# EAGLE design licht (EAGLE 6.6.0)
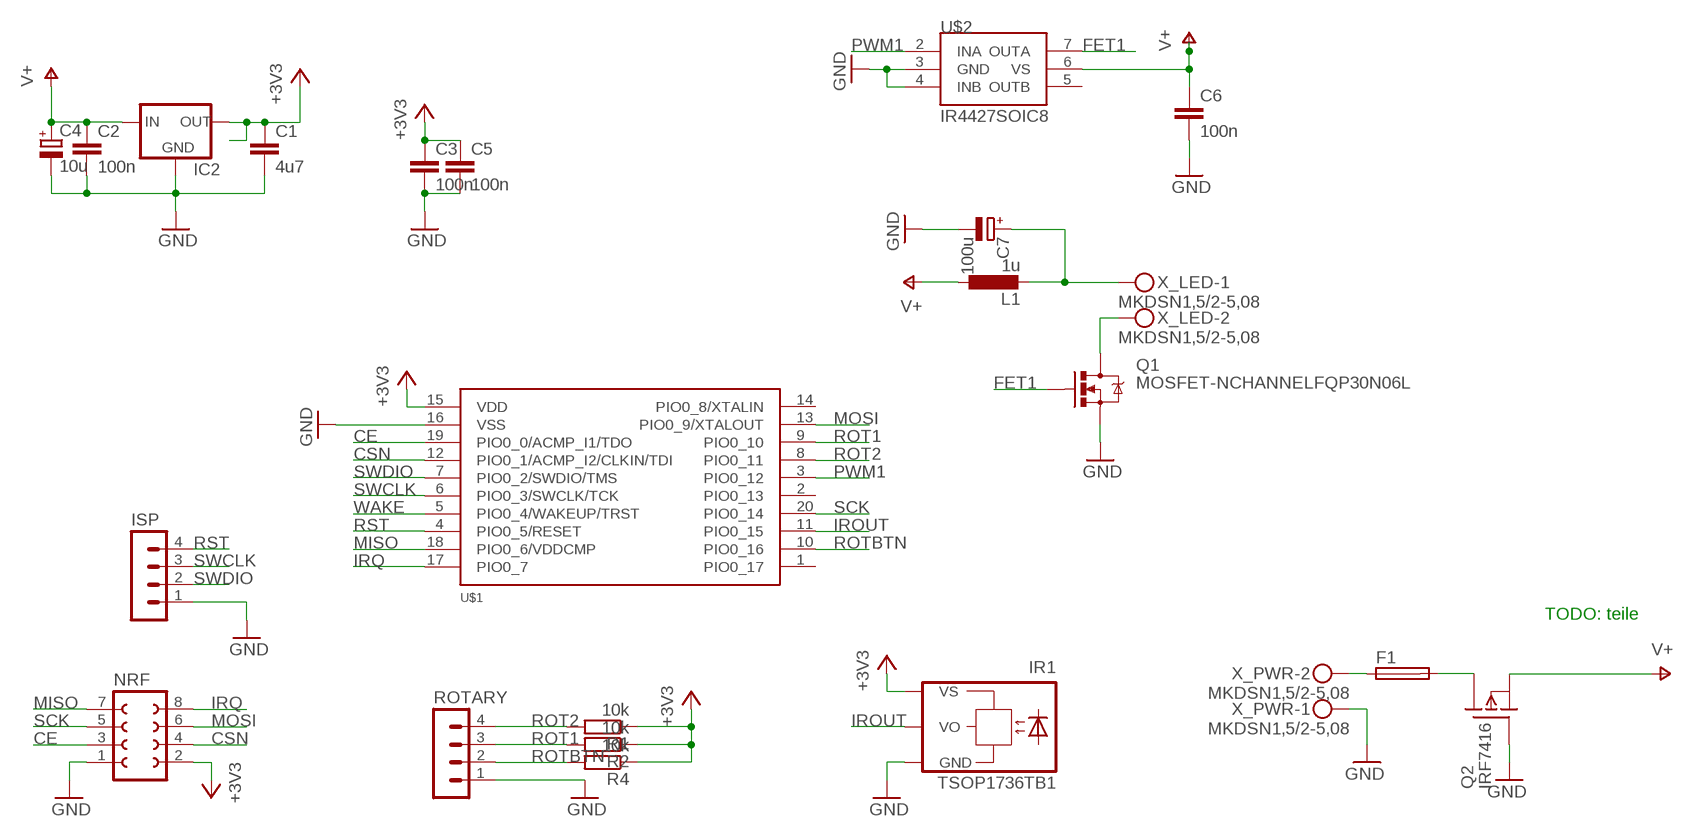
[diagram p0: schematic, sheet 1]

## Parts
C1  4u7  C-EUC0805  [C0805]
C2  100n  C-EUC0805  [C0805]
C3  100n  C-EUC0805  [C0805]
C4  10u  CPOL-EUE2.5-6  [E2,5-6]
C5  100n  C-EUC0805  [C0805]
C6  100n  C-EUC0805  [C0805]
C7  100u  CPOL-EUE2.5-5  [E2,5-5]
F1  PTF45  [PTF45]
IC2  TS2940  [TO252]
IR1  TSOP1736TB1  [TSOP17_TB1]
ISP  MA04-1  [MA04-1]
L1  1u  L-EUPISR-BIGPAD  [PISR-BIGPAD]
NRF  FE04-2  [FE04-2]
Q1  MOSFET-NCHANNELFQP30N06L  [TO220V]
Q2  IRF7416  IRF7205  [SO8]
R1  10k  R-EU_R0805  [R0805]
R2  10k  R-EU_R0805  [R0805]
R4  10k  R-EU_R0805  [R0805]
ROTARY  MA04-1  [MA04-1]
U$1  LPC812M101JD20  [SOIC20WIDE]
U$2  IR4427SOIC8  [SOIC8]
X_LED  MKDSN1,5/2-5,08  [MKDSN1,5/2-5,08]
X_PWR  MKDSN1,5/2-5,08  [MKDSN1,5/2-5,08]

## Nets
+3V3: C1.1 C3.1 C5.1 IC2.3(OUT) IR1.VS NRF.2 R1.1 R2.1 R4.1 U$1.15(VDD)
CE: NRF.3 U$1.19(PIO0_0/ACMP_I1/TDO)
CSN: NRF.4 U$1.12(PIO0_1/ACMP_I2/CLKIN/TDI)
FET1: Q1.1(G) U$2.7(OUTA)
GND: C1.2 C2.2 C3.2 C4.- C5.2 C6.2 C7.- IC2.2(GND) IR1.GND ISP.1 NRF.1 Q1.3(S) Q2.4(G) ROTARY.1 U$1.16(VSS) U$2.3(GND) U$2.4(INB) X_PWR.1
IROUT: IR1.VO U$1.11(PIO0_15)
IRQ: NRF.8 U$1.17(PIO0_7)
MISO: NRF.7 U$1.18(PIO0_6/VDDCMP)
MOSI: NRF.6 U$1.13(PIO0_9/XTALOUT)
N$1: C7.+ L1.2 X_LED.1
N$2: Q1.2(D) X_LED.2
N$3: F1.1 X_PWR.2
N$4: F1.2 Q2.5(D) Q2.6(D) Q2.7(D) Q2.8(D)
PWM1: U$1.3(PIO0_12) U$2.2(INA)
ROT1: R2.2 ROTARY.3 U$1.9(PIO0_10)
ROT2: R1.2 ROTARY.4 U$1.8(PIO0_11)
ROTBTN: R4.2 ROTARY.2 U$1.10(PIO0_16)
RST: ISP.4 U$1.4(PIO0_5/RESET)
SCK: NRF.5 U$1.20(PIO0_14)
SWCLK: ISP.3 U$1.6(PIO0_3/SWCLK/TCK)
SWDIO: ISP.2 U$1.7(PIO0_2/SWDIO/TMS)
V+: C2.1 C4.+ C6.1 IC2.1(IN) L1.1 Q2.1(S) Q2.2(S) Q2.3(S) U$2.6(VS)
WAKE: U$1.5(PIO0_4/WAKEUP/TRST)
Unconnected: U$1.1(PIO0_17) U$1.2(PIO0_13) U$1.14(PIO0_8/XTALIN) U$2.5(OUTB)

## Notes on the sheet
- TODO: teile

## Library data of the parts
C1-C3 C5 C6 = rcl:C-EU: CAPACITOR, European symbol
C4 = rcl:CPOL-EU: POLARIZED CAPACITOR, European symbol
C7 = florolf:CPOL-EU: POLARIZED CAPACITOR, European symbol
F1 = sprawl:PTF45: FUSE HOLDER Reichelt; OC_FARNELL: unknown; OC_NEWARK: unknown; OC_REICHELT: PL 122100
IC2 = sprawl:TS2940: VOLTAGE REGULATOR; OC_REICHELT: TS 2940 CP33
IR1 = tsop1736:TSOP17*TB1: TSOP17..TB1 IR Receiver Modules for Remote Control Systems Source: http://www.vishay.com/docs/82042/82042.pdf; OC_FARNELL: unknown; OC_NEWARK: unknown
ISP ROTARY = con-lstb:MA04-1: PIN HEADER; OC_FARNELL: unknown; OC_NEWARK: unknown
L1 = florolf:L-EU: INDUCTOR, European symbol
NRF = florolf:FE04-2: FEMALE HEADER; OC_FARNELL: unknown; OC_NEWARK: unknown
Q1 = SparkFun-DiscreteSemi:MOSFET-NCHANNEL: Common NMOSFET Parts MFG P/N Store ID Prod ID FDD8780 TRANS-09984 SI7820DN TRANS-11055 FDS6630A IC-08089 2N7002PW TRANS-11151 FQP30N06L COM-10213 TRANS-10060 BSS123LT1G TRANS-08345 BSS138 TRANS-00830 BS170 2N7000; PROD_ID: TRANS-10060
Q2 = sprawl:IRF7205: P-Channel Enhancement MOSFET
R1 R2 R4 = rcl:R-EU_: RESISTOR, European symbol
U$1 = LPC800:LPC812M101JD20
U$2 = florolf:IR4427
X_LED X_PWR = con-phoenix-508:MKDSN1,5/2-5,08: MKDSN 1,5/ 2-5,08 Printklemme Nennstrom: 13,5 A Nennspannung: 250 V Rastermaß: 5,08 mm Polzahl: 2 Anschlussart: Schraubanschluss Montage: Löten Anschlussrichtung Leiter/Platine: 0 ° Artikelnummer: 1729128 Source: http://eshop.phoenixcontact.com .. 1729128.pdf; MPN: MKDSN 1,5/2-5.08; OC_FARNELL: 1792903; OC_NEWARK: 30M2397

## Board
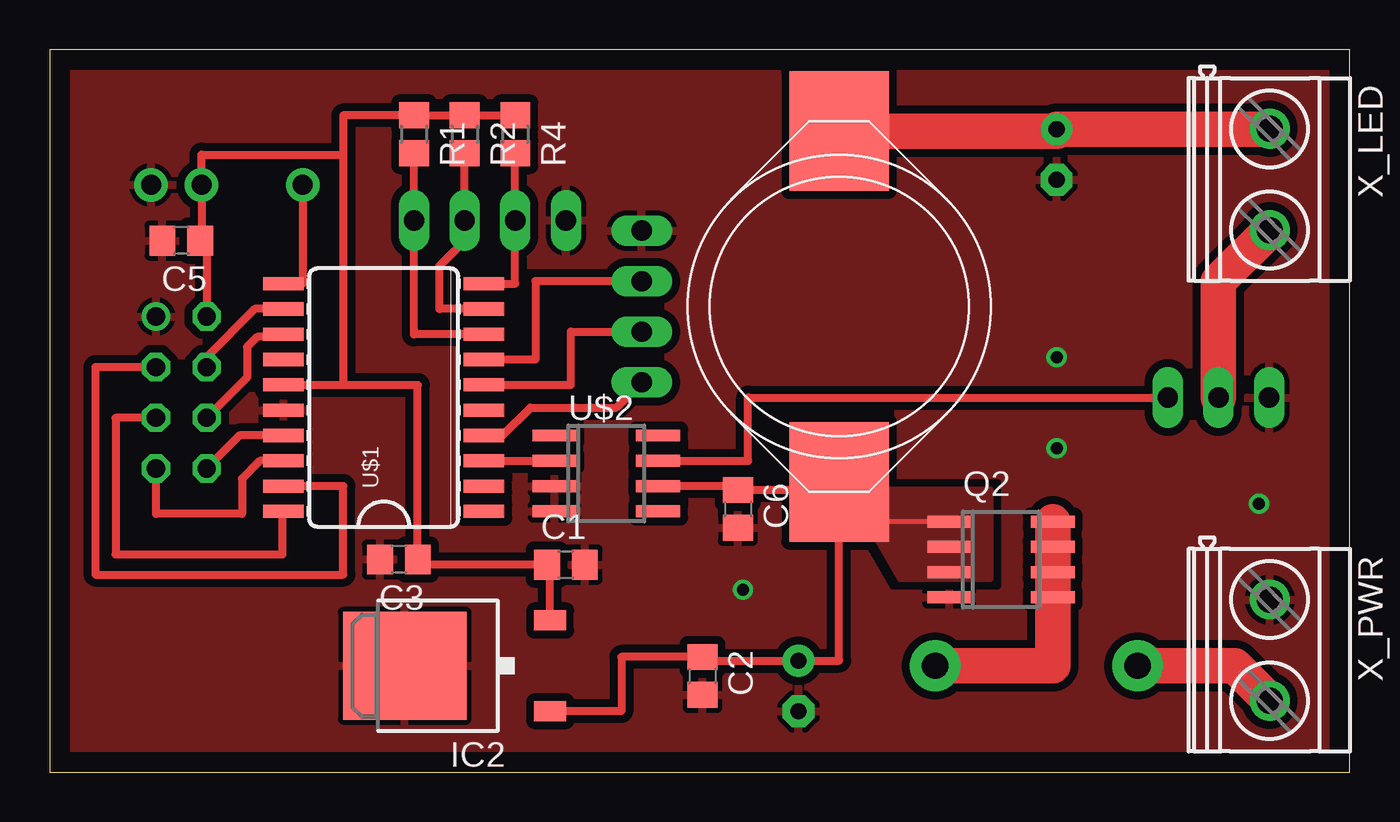
[diagram p1: board, top side]
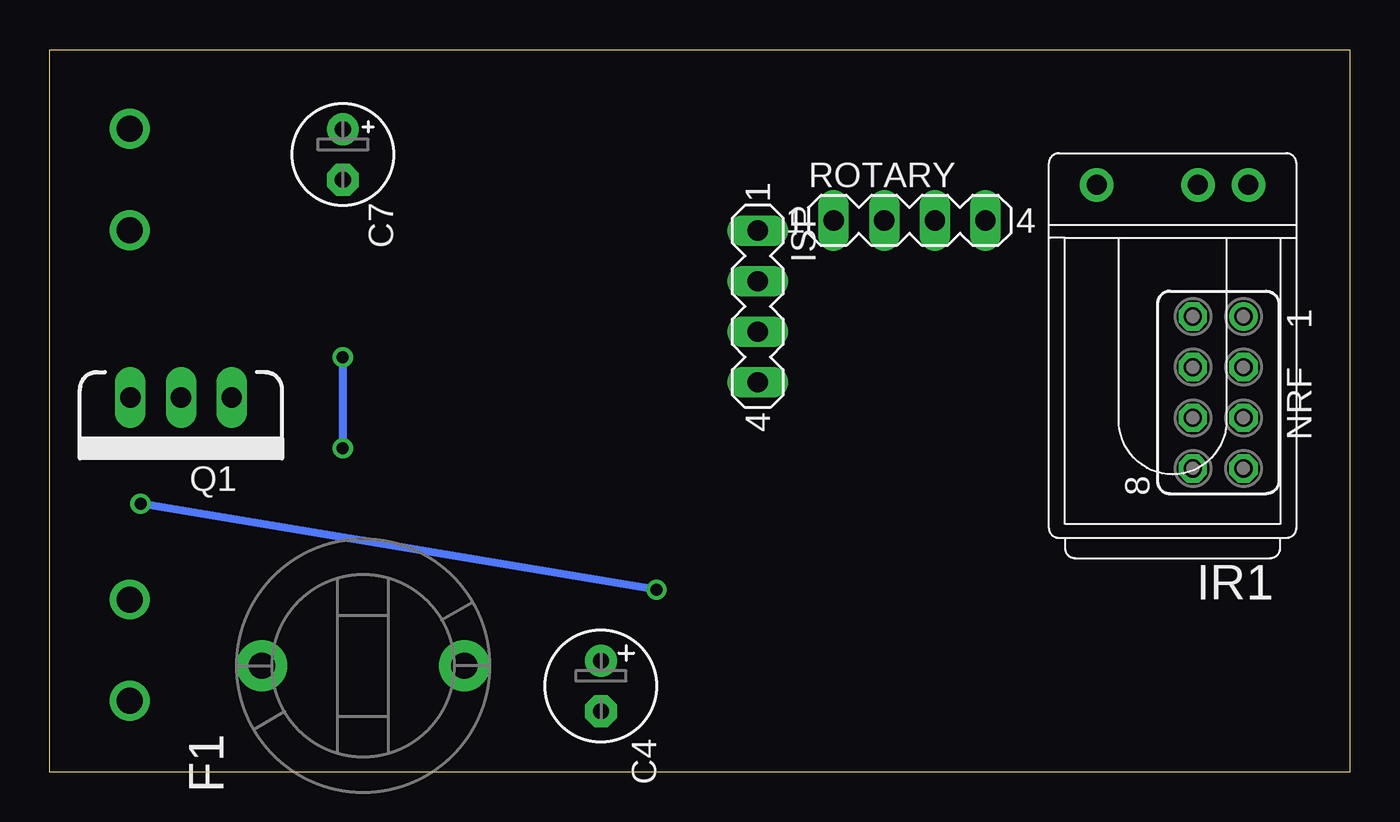
[diagram p2: board, bottom side, seen from below]

Size 65.26 x 36.25 mm. Coordinates in mm from the lower left corner, seen from the top.
Outline: 0,0 65.26,0 65.26,36.25 0,36.25 0,0
Copper layers (1*16): Top 0.035mm / dielectric 1.5mm / Bottom 0.035mm
Design rules "fraesen": minimum track width 10mil, minimum drill 24mil, track to track 0.4mm, track to pad 0.4mm, pad to pad 0.4mm, via to via 0.4mm, smd to smd 0.4mm, copper to edge 40mil, drill to drill 8mil, minimum pad ring 10mil, minimum via ring 8mil, stop-mask expansion 4mil, vias tented up to drill 0mil, thermal gap 10mil

### Footprints (pad centres in the part's own frame; a part is rotated, then mirrored left to right if it is on the bottom)
C0805 = smd 1.3 x 1.5: 1 -0.95,0; 2 0.95,0
E2,5-6 = drill 0.813 pad 1.6: + -1.27,0 | drill 0.813 pad 1.6 octagon: - 1.27,0
E2,5-5 = drill 0.813 pad 1.6: + -1.27,0 | drill 0.813 pad 1.6 octagon: - 1.27,0
PTF45 = drill 1.321 pad 2.54: 1 0,5.08; 2 0,-5.08
TO252 = smd 1 x 1.6: 1 -2.28,-4.8; 3 2.28,-4.8 | smd 5.4 x 6.2: 2 0,2.5
TSOP17_TB1 = drill 1 pad 1.676: GND 0,-3.81; VO 0,3.81; VS 0,-1.27
MA04-1 = drill 1.016 long: 1 -3.81,0; 2 -1.27,0; 3 1.27,0; 4 3.81,0
PISR-BIGPAD = smd 6 x 5: 1 -8.8,0; 2 8.8,0
FE04-2 = drill 0.914: 1 -5.08,1.27 | drill 0.914 octagon: 2 -5.08,-1.27; 3 -2.54,1.27; 4 -2.54,-1.27; 5 0,1.27; 6 0,-1.27; 7 2.54,1.27; 8 2.54,-1.27
TO220V = drill 1.016 long: 1 -2.54,0; 2 0,0; 3 2.54,0
SO8 = smd 0.6 x 2.2: 1 -1.905,-2.6; 2 -0.635,-2.6; 3 0.635,-2.6; 4 1.905,-2.6; 5 1.905,2.6; 6 0.635,2.6; 7 -0.635,2.6; 8 -1.905,2.6
R0805 = smd 1.3 x 1.5: 1 -0.95,0; 2 0.95,0
SOIC20WIDE = smd 0.66 x 2.032: 1 -5.715,-5.029; 2 -4.445,-5.029; 3 -3.175,-5.029; 4 -1.905,-5.029; 5 -0.635,-5.029; 6 0.635,-5.029; 7 1.905,-5.029; 8 3.175,-5.029; 9 4.445,-5.029; 10 5.715,-5.029; 11 5.715,5.029; 12 4.445,5.029; 13 3.175,5.029; 14 1.905,5.029; 15 0.635,5.029; 16 -0.635,5.029; 17 -1.905,5.029; 18 -3.175,5.029; 19 -4.445,5.029; 20 -5.715,5.029
SOIC8 = smd 0.6 x 2.2: 1 -1.905,-2.6; 2 -0.635,-2.6; 3 0.635,-2.6; 4 1.905,-2.6; 5 1.905,2.6; 6 0.635,2.6; 7 -0.635,2.6; 8 -1.905,2.6
MKDSN1,5/2-5,08 = drill 1.3 pad 2: 1 -2.561,0.025; 2 2.519,0.025

### Placement (x,y rotation side)
C1  25.91,10.41 0 top
C2  32.77,4.83 270 top
C3  17.53,10.67 180 top
C4  37.59,4.32 270 bottom
C5  6.6,26.67 180 top
C6  34.54,13.21 270 top
C7  50.55,30.99 270 bottom
F1  49.53,5.33 90 bottom
IC2  20.32,5.33 90 top
IR1  8.89,29.46 90 bottom
ISP  29.72,23.37 270 bottom
L1  39.62,23.37 90 top
NRF  6.6,17.78 270 bottom
Q1  58.67,18.8 180 bottom
Q2  47.75,10.67 270 top
R1  18.29,32 270 top
R2  20.83,32 270 top
R4  23.37,32 270 top
ROTARY  22.1,27.69 0 bottom
U$1  16.76,18.8 90 top
U$2  27.94,14.99 270 top
X_LED  61.21,29.72 270 top
X_PWR  61.21,6.1 270 top

### Tracks (layer width: path | path; a pad name or v marks a point on that pad's centre or on a via)
+3V3
  Top 0.406: 18.48,10.16 C3.1 | NRF.2 7.87,26.35 C5.1 7.62,26.74 IR1.VS 7.62,30.99 14.73,30.99 | U$1.15 14.73,19.43 | 14.73,19.43 18.48,19.43 C3.1 | R4.1 R2.1 R1.1 14.73,32.95 14.73,30.99 | 14.73,30.99 14.73,19.43 | IC2.3 25.12,10.41 C1.1 18.48,10.41 C3.1
CE
  Top 0.406: NRF.3 2.29,20.32 2.29,9.91 14.73,9.91 14.73,14.35 U$1.19
CSN
  Top 0.406: U$1.12 10.29,23.24 7.87,20.83 NRF.4
FET1
  Top 0.406: U$2.7 35.05,15.62 35.05,18.8 Q1.1
GND  (via drill 0.6)
  Bottom 0.406: v34.8,9.14 v60.71,13.46 | v50.55,20.83 v50.55,16.26
  pour Top (rank 2): -4.83,43.43 70.1,43.43 70.1,-6.6 -4.83,-6.6
IROUT
  Top 0.406: IR1.VO 12.7,24.51 U$1.11
IRQ
  Top 0.406: U$1.17 9.53,16.89 NRF.8
MISO
  Top 0.406: U$1.18 10.54,15.62 9.65,14.73 9.65,12.95 5.33,12.95 NRF.7
MOSI
  Top 0.406: U$1.13 11.05,21.97 10.92,21.84 10.41,21.84 9.91,21.34 9.91,19.81 NRF.6
N$1
  Top 1.778: L1.2 50.55,32.17 C7.+ 61.24,32.26 X_LED.1
N$2
  Top 1.778: Q1.2 58.67,24.63 X_LED.2
N$3
  Top 1.778: X_PWR.2 59.48,5.33 F1.1
N$4
  Top 1.778: F1.2 50.35,5.33 Q2.5 Q2.6 Q2.7 Q2.8
PWM1
  Top 0.406: U$1.3 U$2.2
ROT1
  Top 0.406: R2.2 ROTARY.3 20.83,26.67 19.56,25.4 19.56,23.24 U$1.9
ROT2
  Top 0.406: R1.2 ROTARY.4 18.29,21.97 U$1.8
ROTBTN
  Top 0.406: R4.2 ROTARY.2 23.37,24.51 U$1.10
RST
  Top 0.406: U$1.4 22.73,16.89 24.13,18.29 28.45,18.29 ISP.4
SCK
  Top 0.406: NRF.5 3.3,17.78 3.3,10.92 11.68,10.92 11.68,13.08 U$1.20
SWCLK
  Top 0.406: U$1.6 26.16,19.43 26.16,22.1 ISP.3
SWDIO
  Top 0.406: ISP.2 24.38,24.64 24.38,20.7 U$1.7
V+
  Top 0.254: Q2.1 39.62,12.57 39.62,12.95
  Top 0.406: 39.41,14.35 L1.1 arc-90 39.21,14.16 C6.1 34.35,14.35 U$2.6 | 39.62,13.21 39.62,12.95 39.62,5.59 C4.+ 32.95,5.59 C2.1 28.7,5.78 28.7,3.05 IC2.1
  Top 1.778: 39.62,13.21 L1.1
  pour Top (no thermals): 39.88,14.22 47.24,14.22 47.24,9.65 42.67,9.65 41.66,11.43